# EAGLE design Gassensor (EAGLE 5.06)
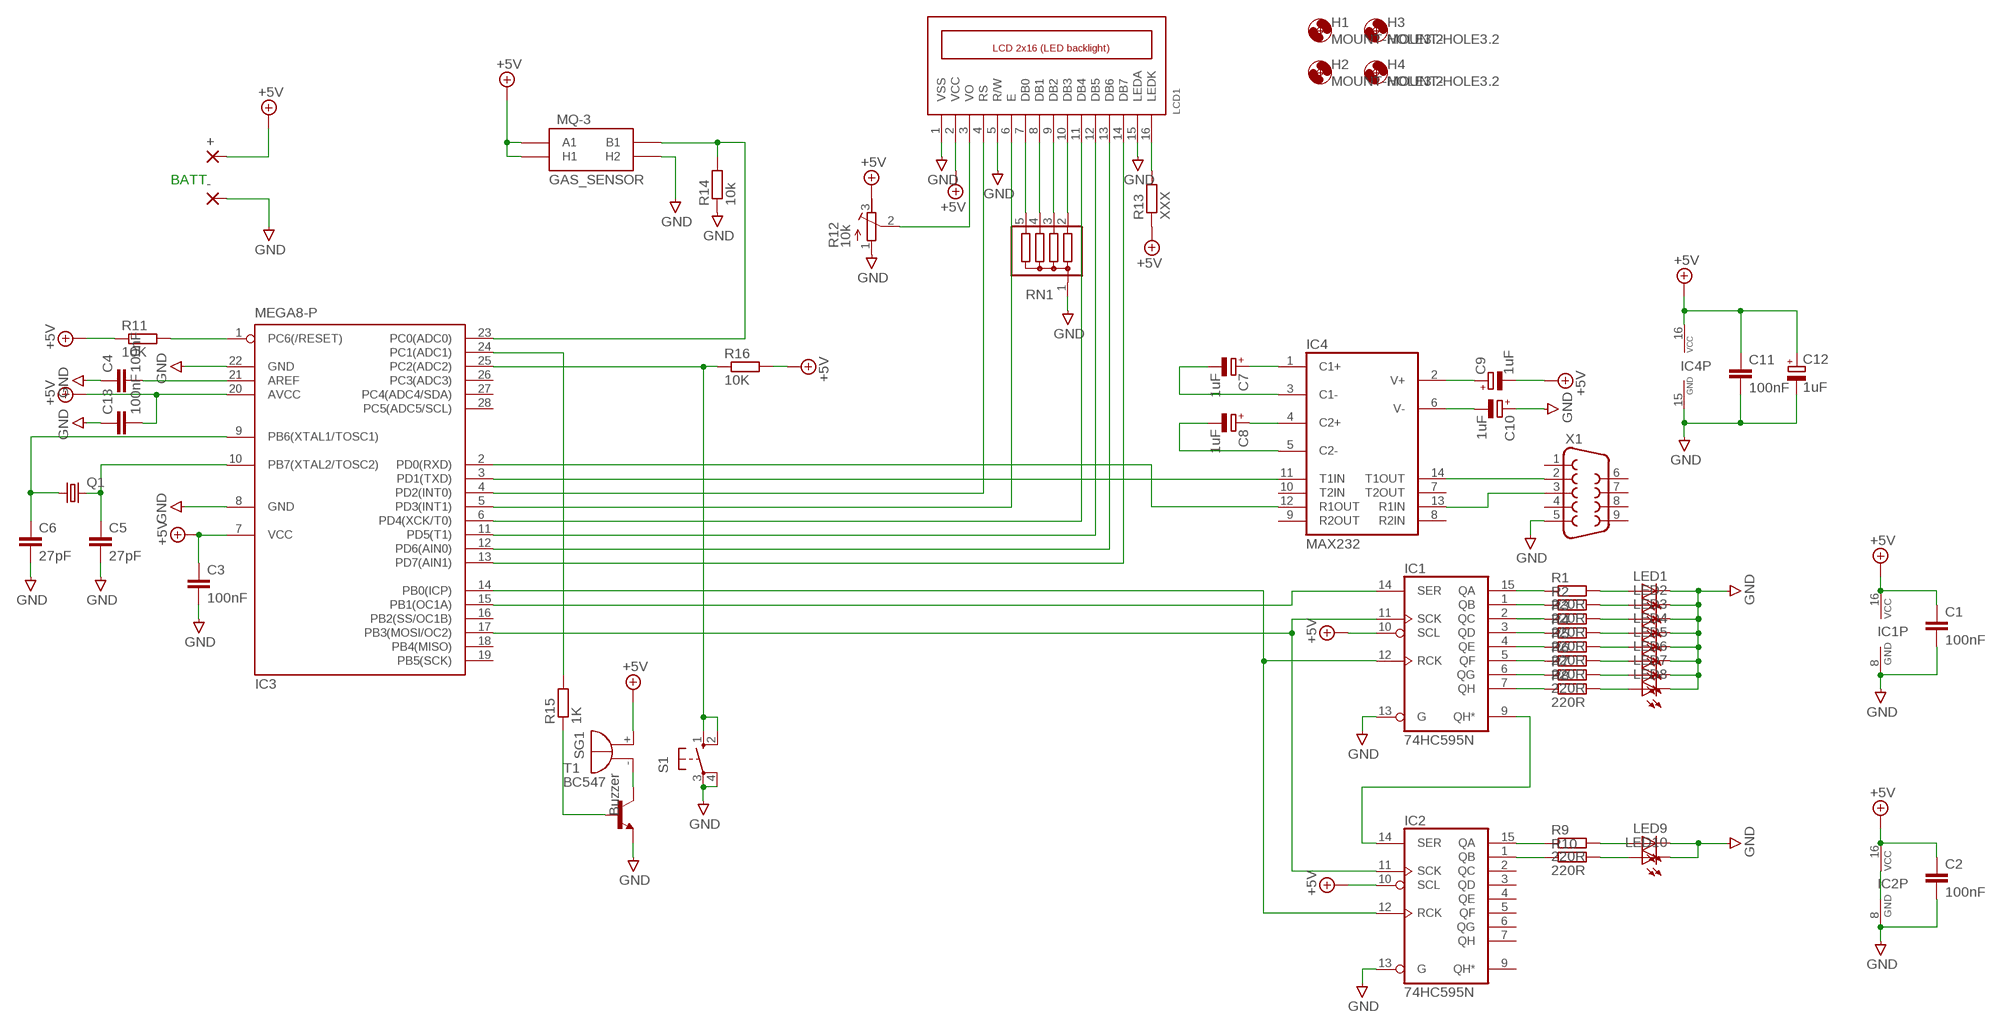
[diagram p0: schematic, sheet 1]

## Parts
+  WIREPAD2,54/1,1  [2,54/1,1]
-  WIREPAD2,54/1,1  [2,54/1,1]
C1  100nF  C-EU025-030X050  [C025-030X050]
C2  100nF  C-EU025-030X050  [C025-030X050]
C3  100nF  C-EU025-030X050  [C025-030X050]
C4  100nF  C-EU025-030X050  [C025-030X050]
C5  27pF  C-EU025-030X050  [C025-030X050]
C6  27pF  C-EU025-030X050  [C025-030X050]
C7  1uF  CPOL-EUE2-5  [E2-5]
C8  1uF  CPOL-EUE2-5  [E2-5]
C9  1uF  CPOL-EUE2-5  [E2-5]
C10  1uF  CPOL-EUE2-5  [E2-5]
C11  100nF  C-EU025-030X050  [C025-030X050]
C12  1uF  CPOL-EUE2-5  [E2-5]
C13  100nF  C-EU025-030X050  [C025-030X050]
H1  MOUNT-HOLE3.2  [3,2]
H2  MOUNT-HOLE3.2  [3,2]
H3  MOUNT-HOLE3.2  [3,2]
H4  MOUNT-HOLE3.2  [3,2]
IC1  74HC595N  [DIL16]
IC2  74HC595N  [DIL16]
IC3  MEGA8-P  [DIL28-3]
IC4  MAX232  [DIL16]
LCD1  LCD_2X16_SIL  [HY-1602F]
LED1  LED5MM  [LED5MM]
LED2  LED5MM  [LED5MM]
LED3  LED5MM  [LED5MM]
LED4  LED5MM  [LED5MM]
LED5  LED5MM  [LED5MM]
LED6  LED5MM  [LED5MM]
LED7  LED5MM  [LED5MM]
LED8  LED5MM  [LED5MM]
LED9  LED5MM  [LED5MM]
LED10  LED5MM  [LED5MM]
MQ-3  GAS_SENSOR  [MQ-3]
Q1  CRYSTALHC49S  [HC49/S]
R1  220R  R-EU_0207/10  [0207/10]
R2  220R  R-EU_0207/10  [0207/10]
R3  220R  R-EU_0207/10  [0207/10]
R4  220R  R-EU_0207/10  [0207/10]
R5  220R  R-EU_0207/10  [0207/10]
R6  220R  R-EU_0207/10  [0207/10]
R7  220R  R-EU_0207/10  [0207/10]
R8  220R  R-EU_0207/10  [0207/10]
R9  220R  R-EU_0207/10  [0207/10]
R10  220R  R-EU_0207/10  [0207/10]
R11  10K  R-EU_0207/10  [0207/10]
R12  10k  R-TRIMM64W  [RTRIM64W]
R13  XXX  R-EU_0207/10  [0207/10]
R14  10k  R-EU_0207/10  [0207/10]
R15  1K  R-EU_0207/10  [0207/10]
R16  10K  R-EU_0207/10  [0207/10]
RN1  G04R  [SIL5]
S1  10-XX  [B3F-10XX]
SG1  Buzzer  EB2209A  [EB2209A]
T1  BC547  [TO92]
X1  F09H  [F09H]

## Nets
+5V: +.1(P) C1.1 C2.1 C3.1 C9.- C11.1 C12.+ C13.2 IC1.10(SCL) IC1.16(VCC) IC2.10(SCL) IC2.16(VCC) IC3.7(VCC) IC3.20(AVCC) IC4.16(VCC) LCD1.2(VCC) MQ-3.A1 MQ-3.HA(H1) R11.1 R12.3(A) R13.1 R16.2 SG1.+
GND: -.1(P) C1.2 C2.2 C3.2 C4.1 C5.2 C6.2 C10.+ C11.2 C12.- C13.1 IC1.8(GND) IC1.13(G) IC2.8(GND) IC2.13(G) IC3.8(GND) IC3.22(GND) IC4.15(GND) LCD1.1(VSS) LCD1.5(R/W) LCD1.15(LEDA) LED1.K(C) LED2.K(C) LED3.K(C) LED4.K(C) LED5.K(C) LED6.K(C) LED7.K(C) LED8.K(C) LED9.K(C) LED10.K(C) MQ-3.HB(H2) R12.1(E) R14.1 RN1.1 S1.3(P) S1.4(P1) T1.1(E) X1.5
N$1: IC1.15(QA) R1.1
N$2: IC1.1(QB) R2.1
N$3: IC1.2(QC) R3.1
N$4: IC1.3(QD) R4.1
N$5: IC1.4(QE) R5.1
N$6: IC1.5(QF) R6.1
N$7: IC1.6(QG) R7.1
N$8: IC1.7(QH) R8.1
N$9: LED1.A R1.2
N$10: LED2.A R2.2
N$11: LED3.A R3.2
N$12: LED4.A R4.2
N$13: LED5.A R5.2
N$14: LED6.A R6.2
N$15: LED7.A R7.2
N$16: LED8.A R8.2
N$17: IC2.15(QA) R9.1
N$18: IC2.1(QB) R10.1
N$19: LED9.A R9.2
N$20: LED10.A R10.2
N$22: LCD1.3(VO) R12.2(S)
N$23: IC3.1(PC6(/RESET)) R11.2
N$24: C4.2 IC3.21(AREF)
N$25: IC1.14(SER) IC3.15(PB1(OC1A))
N$26: IC1.11(SCK) IC2.11(SCK) IC3.17(PB3(MOSI/OC2))
N$27: IC1.12(RCK) IC2.12(RCK) IC3.14(PB0(ICP))
N$28: IC3.24(PC1(ADC1)) R15.2
N$29: C6.1 IC3.9(PB6(XTAL1/TOSC1)) Q1.1
N$30: IC1.9(QH*) IC2.14(SER)
N$31: C5.1 IC3.10(PB7(XTAL2/TOSC2)) Q1.2
N$32: IC3.3(PD1(TXD)) IC4.11(T1IN)
N$33: IC3.2(PD0(RXD)) IC4.12(R1OUT)
N$34: C7.+ IC4.1(C1+)
N$35: C7.- IC4.3(C1-)
N$36: C8.+ IC4.4(C2+)
N$37: C8.- IC4.5(C2-)
N$38: C9.+ IC4.2(V+)
N$39: C10.- IC4.6(V-)
N$40: IC4.14(T1OUT) X1.2
N$41: IC4.13(R1IN) X1.3
N$42: IC3.4(PD2(INT0)) LCD1.4(RS)
N$43: IC3.5(PD3(INT1)) LCD1.6(E)
N$44: IC3.6(PD4(XCK/T0)) LCD1.11(DB4)
N$45: IC3.11(PD5(T1)) LCD1.12(DB5)
N$46: IC3.12(PD6(AIN0)) LCD1.13(DB6)
N$47: IC3.13(PD7(AIN1)) LCD1.14(DB7)
N$48: LCD1.16(LEDK) R13.2
N$49: IC3.23(PC0(ADC0)) MQ-3.B1 R14.2
N$50: IC3.25(PC2(ADC2)) R16.1 S1.1(S) S1.2(S1)
N$51: SG1.- T1.3(C)
N$52: R15.1 T1.2(B)
N$53: LCD1.10(DB3) RN1.2
N$54: LCD1.9(DB2) RN1.3
N$55: LCD1.8(DB1) RN1.4
N$56: LCD1.7(DB0) RN1.5
Unconnected: IC2.2(QC) IC2.3(QD) IC2.4(QE) IC2.5(QF) IC2.6(QG) IC2.7(QH) IC2.9(QH*) IC3.16(PB2(SS/OC1B)) IC3.18(PB4(MISO)) IC3.19(PB5(SCK)) IC3.26(PC3(ADC3)) IC3.27(PC4(ADC4/SDA)) IC3.28(PC5(ADC5/SCL)) IC4.7(T2OUT) IC4.8(R2IN) IC4.9(R2OUT) IC4.10(T2IN) X1.1 X1.4 X1.6 X1.7 X1.8 X1.9

## Notes on the sheet
- BATT

## Library data of the parts
+ - = wirepad:WIREPAD: Wire PAD connect wire on PCB
C1-C6 C11 C13 = rcl:C-EU: CAPACITOR, European symbol
C7-C10 C12 = rcl:CPOL-EU: POLARIZED CAPACITOR, European symbol
H1-H4 = holes:MOUNT-HOLE: MOUNTING HOLE with drill center marker
IC1 IC2 = 74xx-eu:74*595: 8-bit SHIFT REGISTER, output latch
IC3 = atmel:MEGA8-P: MICROCONTROLLER 8 Kbytes FLASH, 1 kbytes SRAM, 512 bytes EEPROM, USART, 4-channel 10 bit ADC, 2-channel 8 bit ADC Pin compatible with Atmega48, ATMega88, ATMega168 Source: avr.lbr
IC4 = maxim-3:MAX232: RS232 TRANSEIVER
LCD1 = lcd_2x16_led_backlight:LCD_2X16_SIL
LED1-LED10 = led-lang:LED: LED OSRAM: - CHIPLED LG R971, LG N971, LY N971, LG Q971, LY Q971, LO R971, LY R971 LH N974, LH R974 LS Q976, LO Q976, LY Q976 LO Q996 - Hyper CHIPLED LW Q18S LB Q993, LB Q99A, LB R99A - SideLED LS A670, LO A670, LY A670, LG A670, LP A670 LB A673, LV A673, LT A673, LW A673 LH A674 LY A675 LS A676, LA A676, LO A676, LY A676, LW A676 LS A679, LY A679, LG A679 - Hyper Micro SIDELED® LS Y876, LA Y876, LO Y876, LY Y876 LT Y87S - SmartLED LW L88C, LW L88S LB L89C, LB L89S, LG L890 LS L89K, LO L89K, LY L89K LS L896, LA L896, LO L896, LY L896 - TOPLED LS T670, LO T670, LY T670, LG T670, LP T670 LSG T670, LSP T670, LSY T670, LOP T670, LYG T670 LG T671, LOG T671, LSG T671 LB T673, LV T673, LT T673, LW T673 LH T674 LS T676, LA T676, LO T676, LY T676, LB T676, LH T676, LSB T676, LW T676 LB T67C, LV T67C, LT T67C, LS T67K, LO T67K, LY T67K, LW E67C LS E67B, LA E67B, LO E67B, LY E67B, LB E67C, LV E67C, LT E67C LW T67C LS T679, LY T679, LG T679 LS T770, LO T770, LY T770, LG T770, LP T770 LB T773, LV T773, LT T773, LW T773 LH T774 LS E675, LA E675, LY E675, LS T675 LS T776, LA T776, LO T776, LY T776, LB T776 LHGB T686 LT T68C, LB T68C - Hyper Mini TOPLED® LB M676 - Mini TOPLED Santana® LG M470 LS M47K, LO M47K, LY M47K Source: http://www.osram.convergy.de - LUMILED® LXK2-PW12-R00, LXK2-PW12-S00, LXK2-PW14-U00, LXK2-PW14-V00 LXK2-PM12-R00, LXK2-PM12-S00, LXK2-PM14-U00 LXK2-PE12-Q00, LXK2-PE12-R00, LXK2-PE12-S00, LXK2-PE14-T00, LXK2-PE14-U00 LXK2-PB12-K00, LXK2-PB12-L00, LXK2-PB12-M00, LXK2-PB14-N00, LXK2-PB14-P00, LXK2-PB14-Q00 LXK2-PR12-L00, LXK2-PR12-M00, LXK2-PR14-Q00, LXK2-PR14-R00 LXK2-PD12-Q00, LXK2-PD12-R00, LXK2-PD12-S00 LXK2-PH12-R00, LXK2-PH12-S00 LXK2-PL12-P00, LXK2-PL12-Q00, LXK2-PL12-R00 Source: www.luxeon.com
MQ-3 = SparkFun:GAS_SENSOR: MQ-3 Gas Sensor. FP not tested. Part#
Q1 = crystal:CRYSTAL: CRYSTAL
R1-R11 R13-R16 = rcl:R-EU_: RESISTOR, European symbol
R12 = rcl:R-TRIMM: Trimm resistor
RN1 = resistor-sil:G04R: SIL RESISTOR
S1 = switch-omron:10-XX: OMRON SWITCH
SG1 = buzzer:EB2209A: BUZZER Source: Buerklin
T1 = transistor-neu-to92:BC547: NPN TRANSISTOR
X1 = con-subd:F09: SUB-D

## Board
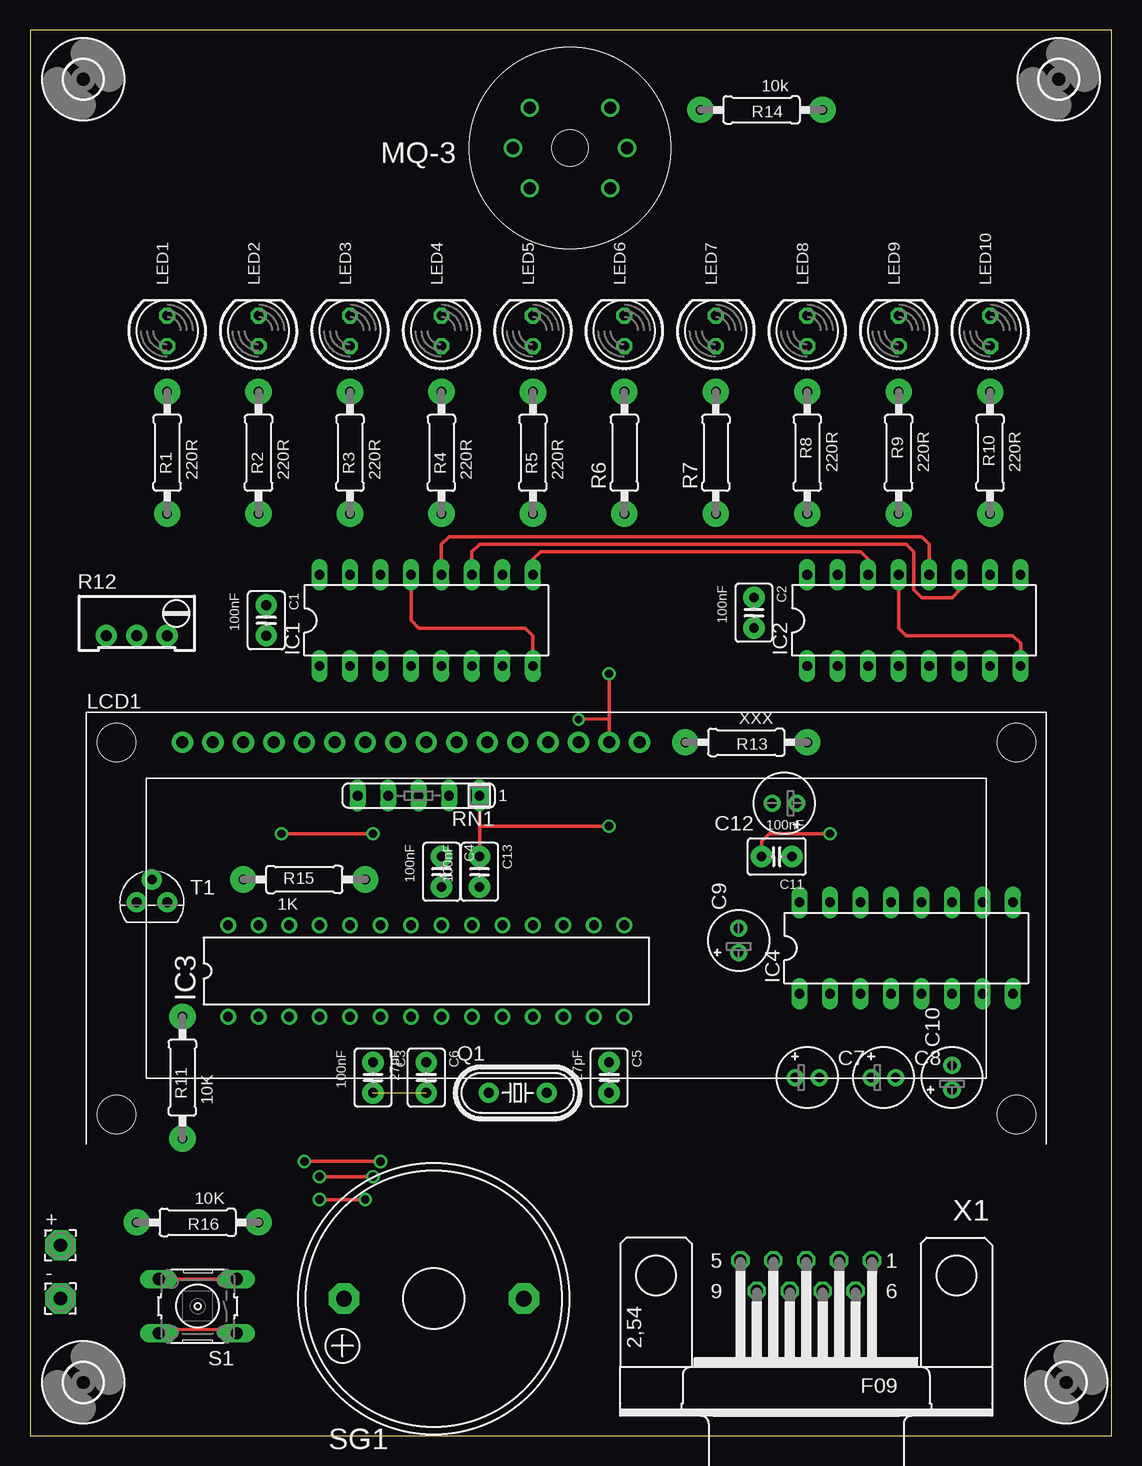
[diagram p1: board, top side]
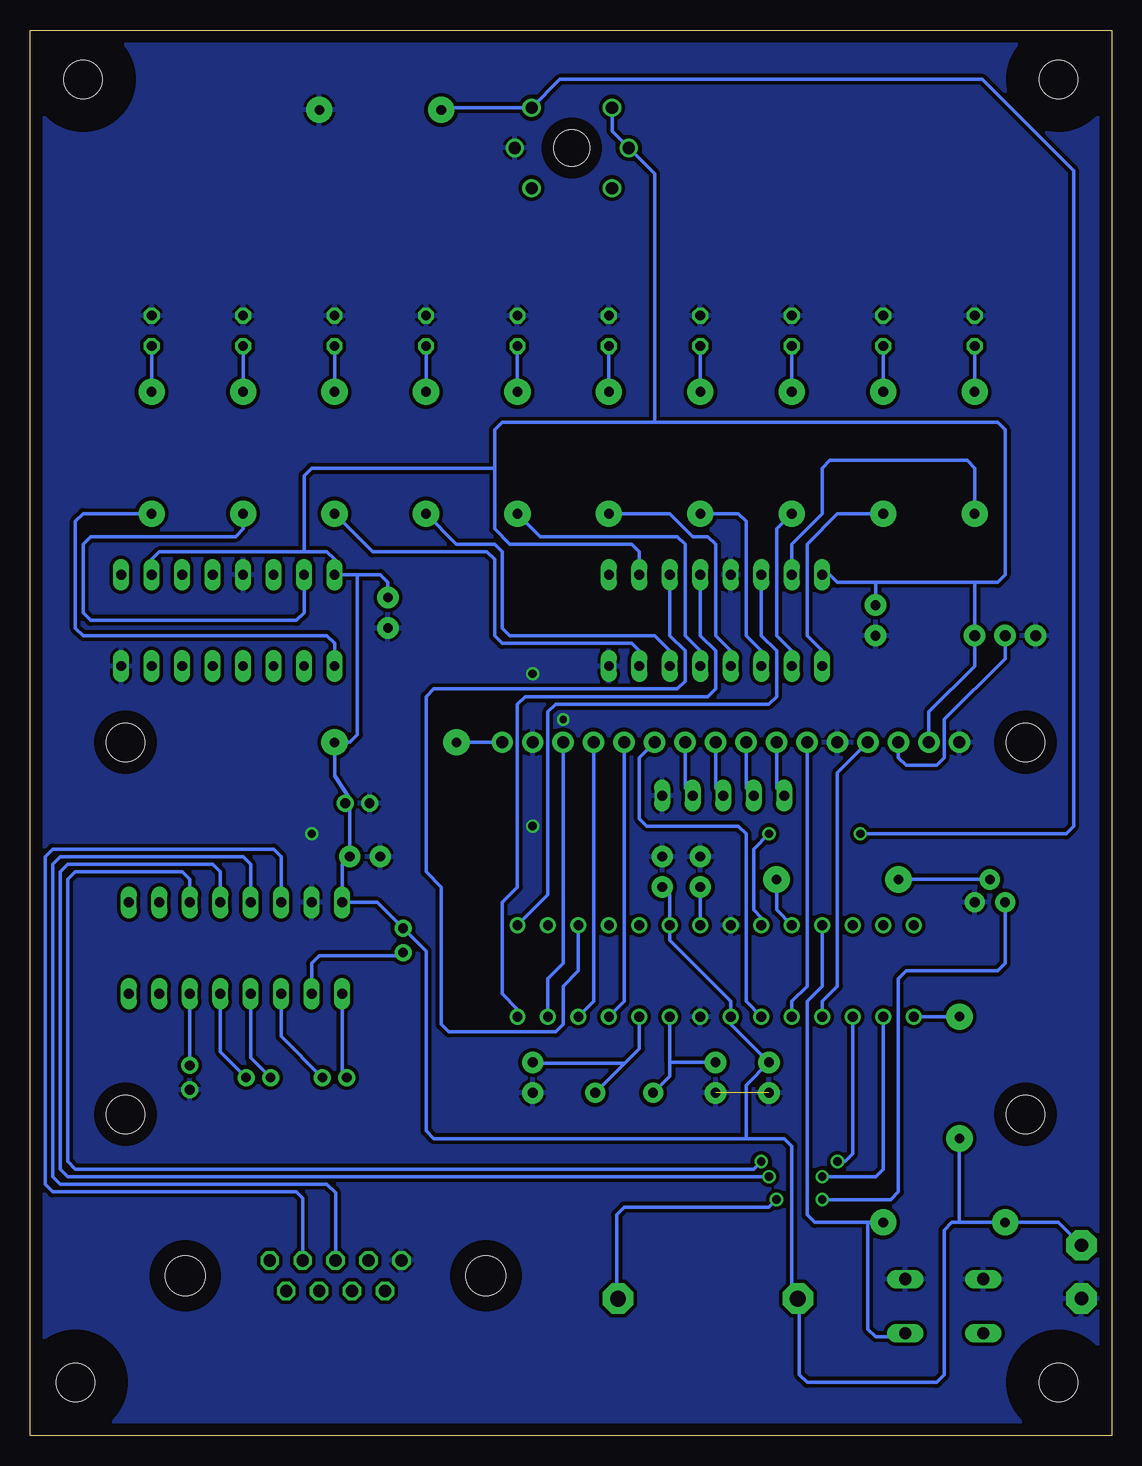
[diagram p2: board, bottom side, seen from below]

Size 90.15 x 117.14 mm. Coordinates in mm from the lower left corner, seen from the top.
Outline: 0,0 90.15,0 90.15,117.14 0,117.14 0,0
Copper layers (1*16): Top 0.035mm / dielectric 1.5mm / Bottom 0.035mm
Design rules "default": minimum track width 10mil, minimum drill 24mil, track to track 8mil, track to pad 8mil, pad to pad 8mil, via to via 8mil, smd to smd 8mil, copper to edge 40mil, drill to drill 8mil, minimum pad ring 10mil, minimum via ring 8mil, stop-mask expansion 4mil, vias tented up to drill 0mil, thermal gap 10mil

### Footprints (pad centres in the part's own frame; a part is rotated, then mirrored left to right if it is on the bottom)
2,54/1,1 = drill 1.118 pad 2.54 octagon: 1 0,0
C025-030X050 = drill 0.813 pad 1.778 round: 1 -1.27,0; 2 1.27,0
E2-5 = drill 0.8 pad 1.422 round: + -1.016,0; - 1.016,0
3,2 = hole 3.2: 0,0
DIL16 = drill 0.813 long: 1 -8.89,-3.81; 2 -6.35,-3.81; 3 -3.81,-3.81; 4 -1.27,-3.81; 5 1.27,-3.81; 6 3.81,-3.81; 7 6.35,-3.81; 8 8.89,-3.81; 9 8.89,3.81; 10 6.35,3.81; 11 3.81,3.81; 12 1.27,3.81; 13 -1.27,3.81; 14 -3.81,3.81; 15 -6.35,3.81; 16 -8.89,3.81
DIL28-3 = drill 0.813 round: 1 -16.51,-3.81; 2 -13.97,-3.81; 3 -11.43,-3.81; 4 -8.89,-3.81; 5 -6.35,-3.81; 6 -3.81,-3.81; 7 -1.27,-3.81; 8 1.27,-3.81; 9 3.81,-3.81; 10 6.35,-3.81; 11 8.89,-3.81; 12 11.43,-3.81; 13 13.97,-3.81; 14 16.51,-3.81; 15 16.51,3.81; 16 13.97,3.81; 17 11.43,3.81; 18 8.89,3.81; 19 6.35,3.81; 20 3.81,3.81; 21 1.27,3.81; 22 -1.27,3.81; 23 -3.81,3.81; 24 -6.35,3.81; 25 -8.89,3.81; 26 -11.43,3.81; 27 -13.97,3.81; 28 -16.51,3.81
HY-1602F = drill 1 pad 1.778 round: 1 2.54,0; 2 5.08,0; 3 7.62,0; 4 10.16,0; 5 12.7,0; 6 15.24,0; 7 17.78,0; 8 20.32,0; 9 22.86,0; 10 25.4,0; 11 27.94,0; 12 30.48,0; 13 33.02,0; 14 35.56,0; 15 38.1,0; 16 40.64,0 | hole 3.2: -2.96,0; 72.04,0; -2.96,-31; 72.04,-31
LED5MM = drill 0.813 octagon: A -1.27,0; K 1.27,0
MQ-3 = drill 1.016 round: A1 -3.35,3.35; A2 -3.35,-3.35; B1 3.35,3.35; B2 3.35,-3.35; HA -4.75,0; HB 4.75,0 | hole 3: 0,0
HC49/S = drill 0.813 pad 1.676 round: 1 -2.413,0; 2 2.413,0
0207/10 = drill 0.8 pad 2.184 round: 1 -5.08,0; 2 5.08,0
RTRIM64W = drill 0.9 pad 1.778 round: 1 1.27,-2.54; 2 1.27,0; 3 1.27,2.54
SIL5 = drill 0.813 long: 1 -5.08,0; 2 -2.54,0; 3 0,0; 4 2.54,0; 5 5.08,0
B3F-10XX = drill 1.016 long: 1 -3.251,2.261; 2 3.251,2.261; 3 -3.251,-2.261; 4 3.251,-2.261
EB2209A = drill 1.321 pad 2.54 octagon: + 7.493,0; - -7.493,0
TO92 = drill 0.813 pad 1.676 round: 1 1.27,0; 2 0,1.905; 3 -1.27,0
F09H = drill 1.016 octagon: 1 -5.486,-1.27; 2 -2.743,-1.27; 3 0,-1.27; 4 2.743,-1.27; 5 5.486,-1.27; 6 -4.115,1.27; 7 -1.372,1.27; 8 1.372,1.27; 9 4.115,1.27 | hole 3.302: -12.522,0; 12.522,0

### Placement (x,y rotation side)
+  2.54,15.88 0 top
-  2.54,11.43 0 top
C1  19.68,67.94 270 top
C2  60.33,68.58 270 top
C3  28.57,29.84 270 top
C4  34.29,46.99 270 top
C5  48.26,29.84 270 top
C6  33.02,29.84 270 top
C7  64.77,29.84 0 top
C8  71.12,29.84 0 top
C9  59.05,41.27 90 top
C10  76.83,29.84 90 top
C11  62.23,48.26 180 top
C12  62.87,52.7 180 top
C13  37.47,46.99 270 top
H1  4.45,4.45 0 top
H2  86.36,4.45 0 top
H3  4.45,113.03 0 top
H4  85.72,113.03 0 top
IC1  33.02,67.94 0 top
IC2  73.66,67.94 0 top
IC3  33.02,38.73 0 top
IC4  73.03,40.64 0 top
LCD1  10.16,57.78 0 top
LED1  11.43,92.08 90 top
LED2  19.05,92.08 90 top
LED3  26.67,92.08 90 top
LED4  34.29,92.08 90 top
LED5  41.91,92.08 90 top
LED6  49.53,92.08 90 top
LED7  57.15,92.08 90 top
LED8  64.77,92.08 90 top
LED9  72.39,92.08 90 top
LED10  80.01,92.08 90 top
MQ-3  45,107.31 0 top
Q1  40.64,28.57 0 top
R1  11.43,81.92 90 top
R2  19.05,81.92 90 top
R3  26.67,81.92 90 top
R4  34.29,81.92 90 top
R5  41.91,81.92 90 top
R6  49.53,81.92 90 top
R7  57.15,81.92 90 top
R8  64.77,81.92 90 top
R9  72.39,81.92 90 top
R10  80.01,81.92 90 top
R11  12.7,29.84 90 top
R12  8.89,67.94 270 top
R13  59.69,57.78 180 top
R14  60.96,110.49 180 top
R15  22.86,46.35 0 top
R16  13.97,17.78 180 top
RN1  32.38,53.34 180 top
S1  13.97,10.79 180 top
SG1  33.66,11.43 180 top
T1  10.16,44.45 0 top
X1  64.69,13.34 180 top

### Tracks (layer width: path | path; a pad name or v marks a point on that pad's centre or on a via)
+5V
  Bottom 0.305: +.1 4.45,17.78 R16.2 12.7,17.78 | 12.7,17.78 13.34,17.78 13.97,17.14 13.97,5.08 14.61,4.45 25.4,4.45 26.04,5.08 26.04,11.3 SG1.+ 26.16,11.56 26.67,12.06 26.67,24.13 27.3,24.77 30.48,24.77 | 12.7,17.78 R11.1 | MQ-3.A1 41.65,108.72 MQ-3.HA 38.1,105.17 38.1,84.45 | 11.43,71.12 R12.3 11.43,64.14 15.24,60.33 LCD1.2 | 11.43,71.12 9.53,71.12 8.89,71.75 8.89,83.82 9.53,84.45 38.1,84.45 | 11.43,71.12 19.68,71.12 | 19.68,71.12 22.86,71.12 23.5,71.75 IC1.16 | 19.68,71.12 C1.1 | IC2.10 80.01,73.03 79.38,73.66 67.31,73.66 | 67.31,73.66 65.41,73.66 64.77,73.03 IC2.16 62.87,71.75 | IC1.10 39.37,73.66 40.01,74.3 50.16,74.3 51.44,75.56 51.44,80.64 | 51.44,80.64 51.44,83.82 50.8,84.45 38.1,84.45 | 51.44,80.64 66.67,80.64 67.31,80.01 67.31,73.66 | C13.2 36.83,45.09 IC3.20 36.83,41.27 31.75,36.2 IC3.7 31.75,34.29 C3.1 30.48,29.21 30.48,24.77 | 62.87,71.75 60.96,71.75 60.33,71.12 C2.1 | 62.87,71.75 62.87,58.42 63.5,57.78 R13.1 64.77,54.99 63.5,53.09 C12.+ 63.5,52.32 C11.1 64.14,47.62 IC4.16 61.21,44.45 C9.- 57.15,40.39 57.15,25.4 56.52,24.77 30.48,24.77
GND  (via drill 0.61, 0.7)  (1 unrouted)
  Top 0.254: 48.26,59.69 v45.72,59.69
  Top 0.305: IC2.8 82.55,66.04 81.92,66.67 73.03,66.67 72.39,67.31 IC2.13 | LCD1.15 48.26,59.69 v48.26,63.5 | IC1.8 41.91,66.67 41.27,67.31 32.38,67.31 31.75,67.94 IC1.13 | C13.1 37.47,50.8 | 37.47,50.8 RN1.1 | 37.47,50.8 v48.26,50.8 | C11.2 60.96,49.53 61.59,50.16 v66.67,50.16 | S1.4 S1.3
  pour Bottom (isolate 0.305): 0,117.47 90.17,117.47 90.17,0 0,0
N$1
  Bottom 0.305: R1.1 11.43,80.64 12.06,81.28 23.5,81.28 24.13,80.64 24.13,76.83 26.67,74.3 IC1.15
N$2
  Bottom 0.305: IC1.1 24.13,65.41 25.4,66.67 25.4,74.3 22.86,76.83 R2.1
N$3
  Bottom 0.305: R3.1 27.94,75.56 27.94,66.67 26.67,65.41 IC1.2
N$4
  Bottom 0.305: R4.1 31.11,76.83 30.48,76.2 30.48,66.67 29.21,65.41 IC1.3
N$5
  Bottom 0.305: R5.1 36.83,76.83 34.92,74.93 33.66,74.93 33.02,74.3 33.02,66.67 31.75,65.41 IC1.4
N$6
  Bottom 0.305: R6.1 47.62,74.93 36.2,74.93 35.56,74.3 35.56,66.67 34.29,65.41 IC1.5
N$7
  Bottom 0.305: R7.1 54.61,74.3 51.44,74.3 50.8,73.66 50.8,67.31 50.16,66.67 38.1,66.67 36.83,65.41 IC1.6
N$8
  Bottom 0.305: R8.1 61.59,73.66 52.07,73.66 51.44,73.03 51.44,66.67 50.8,66.04 40.01,66.04 39.37,65.41 IC1.7
N$9
  Bottom 0.305: R1.2 LED1.A
N$10
  Bottom 0.305: R2.2 LED2.A
N$11
  Bottom 0.305: R3.2 LED3.A
N$12
  Bottom 0.305: R4.2 LED4.A
N$13
  Bottom 0.305: R5.2 LED5.A
N$14
  Bottom 0.305: R6.2 LED6.A
N$15
  Bottom 0.305: R7.2 LED7.A
N$16
  Bottom 0.305: R8.2 LED8.A
N$17
  Bottom 0.305: R9.1 72.39,75.56 73.03,74.93 85.09,74.93 85.72,74.3 85.72,68.58 85.09,67.94 67.94,67.94 67.31,68.58 IC2.15
N$18
  Bottom 0.305: R10.1 85.72,76.83 86.36,76.2 86.36,67.31 85.72,66.67 65.41,66.67 64.77,66.04 IC2.1
N$19
  Bottom 0.305: R9.2 LED9.A
N$20
  Bottom 0.305: R10.2 LED10.A
N$22
  Bottom 0.305: LCD1.3 17.78,56.52 17.14,55.88 14.61,55.88 13.97,56.52 13.97,59.69 8.89,64.77 R12.2 8.89,67.31
N$23
  Bottom 0.305: R11.2 IC3.1
N$24
  Bottom 0.305: IC3.21 C4.2
N$25
  Bottom 0.305: IC1.14 29.21,66.67 27.94,65.41 27.94,61.59 28.57,60.96 46.35,60.96 46.99,60.33 46.99,45.09 IC3.15
N$26
  Top 0.305: IC1.11 36.83,73.66 37.47,74.3 73.03,74.3 73.66,73.66 73.66,70.48 74.3,69.85 76.83,69.85 77.47,70.48 IC2.11
  Bottom 0.305: IC1.11 36.83,66.67 35.56,65.41 35.56,62.87 36.2,62.23 56.52,62.23 57.15,61.59 57.15,46.99 55.88,45.72 55.88,34.29 55.24,33.66 46.35,33.66 45.72,34.29 45.72,37.47 44.45,38.73 IC3.17
N$27
  Top 0.305: IC1.12 34.29,74.3 34.92,74.93 74.3,74.93 74.93,74.3 IC2.12
  Bottom 0.305: IC1.12 34.29,66.67 33.02,65.41 33.02,62.23 33.66,61.59 48.9,61.59 49.53,60.96 49.53,45.72 50.8,44.45 50.8,36.83 49.53,35.56 IC3.14
N$28
  Bottom 0.305: IC3.24 27.94,43.81 R15.2
N$29
  Bottom 0.305: Q1.1 36.83,29.97 36.83,31.11 | 36.83,31.11 IC3.9 | C6.1 36.83,31.11
N$30
  Top 0.305: IC2.14 69.85,73.03 69.22,73.66 42.55,73.66 41.91,73.03 IC1.9
N$31
  Bottom 0.305: Q1.2 40.58,31.05 | 40.58,31.05 39.37,32.26 IC3.10 | C5.1 48.2,31.05 40.58,31.05
N$32  (via drill 0.7)
  Top 0.305: v22.86,22.86 v29.21,22.86
  Bottom 0.305: IC4.11 76.83,46.35 77.47,46.99 86.36,46.99 87,46.35 87,22.86 86.36,22.23 29.84,22.23 v29.21,22.86 | IC3.3 21.59,23.5 22.23,22.86 v22.86,22.86
N$33  (via drill 0.7)
  Top 0.305: v24.13,21.59 v28.57,21.59
  Bottom 0.305: IC4.12 74.3,46.99 74.93,47.62 87,47.62 87.63,46.99 87.63,22.23 87,21.59 v28.57,21.59 | v24.13,21.59 19.68,21.59 19.05,22.23 IC3.2
N$34
  Bottom 0.305: C7.+ 64.14,30.23 IC4.1
N$35
  Bottom 0.305: C7.- 69.22,33.27 IC4.3
N$36
  Bottom 0.305: C8.+ 71.75,31.5 IC4.4
N$37
  Bottom 0.305: C8.- 74.3,32 IC4.5
N$38
  Bottom 0.305: C9.+ 59.31,40.01 66.04,40.01 66.67,39.37 IC4.2
N$39
  Bottom 0.305: C10.- IC4.6
N$40
  Bottom 0.305: IC4.14 69.22,48.26 69.85,48.9 88.27,48.9 88.9,48.26 88.9,20.95 88.27,20.32 67.94,20.32 67.43,19.8 X1.2
N$41
  Bottom 0.305: IC4.13 71.75,47.62 72.39,48.26 87.63,48.26 88.27,47.62 88.27,21.59 87.63,20.95 65.41,20.95 64.69,20.23 X1.3
N$42
  Bottom 0.305: LCD1.4 22.86,55.24 22.86,37.47 24.13,36.2 IC3.4
N$43
  Bottom 0.305: LCD1.6 25.4,37.47 26.67,36.2 IC3.5
N$44
  Bottom 0.305: LCD1.11 39.37,56.52 39.37,51.44 38.73,50.8 31.11,50.8 30.48,50.16 30.48,36.2 IC3.6
N$45
  Bottom 0.305: IC3.11 40.64,36.2 LCD1.12
N$46
  Bottom 0.305: IC3.12 43.18,36.2 LCD1.13
N$47
  Bottom 0.305: LCD1.14 45.72,39.37 46.99,38.1 IC3.13
N$48
  Bottom 0.305: LCD1.16 R13.2
N$49  (via drill 0.7)
  Top 0.305: v20.95,50.16 v28.57,50.16
  Bottom 0.305: R14.2 55.7,110.67 MQ-3.B1 45.98,113.03 10.79,113.03 3.17,105.41 3.17,50.8 3.81,50.16 v20.95,50.16 | v28.57,50.16 29.84,48.9 29.84,43.81 29.21,43.18 IC3.23
N$50
  Top 0.254: S1.2 11.43,8.89 16.51,8.89 S1.1
  Bottom 0.305: IC3.25 24.13,37.47 25.4,36.2 25.4,18.41 24.77,17.78 20.32,17.78 | 20.32,17.78 R16.1 | S1.1 17.5,8.26 19.68,8.26 20.32,8.89 20.32,17.78
N$51  (via drill 0.7)
  Top 0.305: v24.13,19.68 v27.94,19.68
  Bottom 0.305: SG1.- 41.27,11.56 41.27,18.41 40.64,19.05 28.57,19.05 v27.94,19.68 | v24.13,19.68 18.41,19.68 17.78,20.32 17.78,38.1 17.14,38.73 9.53,38.73 8.89,39.37 T1.3
N$52
  Bottom 0.305: T1.2 R15.1
N$53
  Bottom 0.305: RN1.2 35.56,53.98 LCD1.10
N$54
  Bottom 0.305: RN1.3 33.02,53.98 LCD1.9
N$55
  Bottom 0.305: RN1.4 30.48,53.98 LCD1.8
N$56
  Bottom 0.305: RN1.5 27.94,53.98 LCD1.7

### Text on the board
tNames: MQ-3